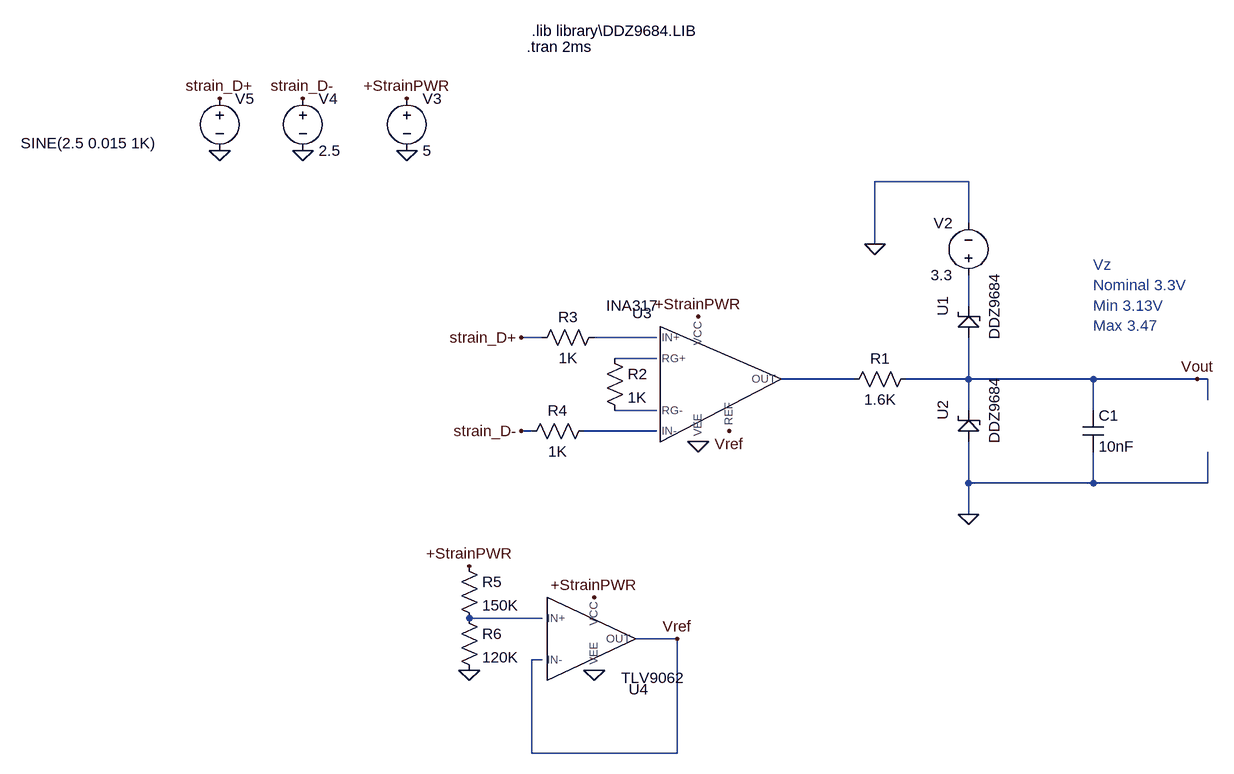
[diagram p0: schematic amplifierClamped.asc]
amplifierClamped.asc, the LTspice schematic file:
Version 4.1
SHEET 1 900 804
WIRE 448 -192 304 -192
WIRE 448 -128 448 -192
WIRE 304 -96 304 -192
WIRE 448 0 448 -48
WIRE -208 48 -240 48
WIRE -32 48 -128 48
WIRE -32 80 -96 80
WIRE 272 112 160 112
WIRE 448 112 448 48
WIRE 448 112 352 112
WIRE 640 112 448 112
WIRE 800 112 640 112
WIRE 816 112 800 112
WIRE 816 144 816 112
WIRE -32 160 -96 160
WIRE 448 160 448 112
WIRE 640 160 640 112
WIRE -224 192 -240 192
WIRE -32 192 -144 192
WIRE 448 272 448 208
WIRE 640 272 640 224
WIRE 640 272 448 272
WIRE 816 272 816 224
WIRE 816 272 640 272
WIRE 448 320 448 272
WIRE -208 480 -320 480
WIRE 0 512 -64 512
WIRE -208 544 -224 544
WIRE -224 688 -224 544
WIRE 0 688 0 512
WIRE 0 688 -224 688
FLAG 448 320 0
FLAG 304 -96 0
FLAG 800 112 Vout
FLAG -416 -240 0
FLAG -320 560 0
FLAG 0 512 Vref
FLAG 32 208 0
FLAG -128 560 0
FLAG 80 192 Vref
FLAG -576 -320 strain_D-
FLAG -576 -240 0
FLAG -704 -320 strain_D+
FLAG -704 -240 0
FLAG -240 192 strain_D-
FLAG -240 48 strain_D+
FLAG -416 -320 +StrainPWR
FLAG 32 16 +StrainPWR
FLAG -128 448 +StrainPWR
FLAG -320 400 +StrainPWR
SYMBOL res 368 96 R90
WINDOW 0 0 56 VBottom 2
WINDOW 3 32 56 VTop 2
SYMATTR InstName R1
SYMATTR Value 1.6K
SYMBOL voltage 448 -32 R180
WINDOW 0 24 96 Left 2
WINDOW 3 24 16 Left 2
WINDOW 123 0 0 Left 0
WINDOW 39 0 0 Left 0
SYMATTR InstName V2
SYMATTR Value 3.3
SYMBOL cap 624 160 R0
SYMATTR InstName C1
SYMATTR Value 10nF
SYMBOL library\\DDZ9684 448 0 R270
SYMATTR InstName U1
SYMBOL library\\DDZ9684 448 160 R270
SYMATTR InstName U2
SYMBOL library\\INA317 32 112 R0
SYMATTR InstName U3
SYMBOL res -112 64 R0
SYMATTR InstName R2
SYMATTR Value 1K
SYMBOL voltage -416 -336 R0
WINDOW 123 0 0 Left 0
WINDOW 39 0 0 Left 0
SYMATTR InstName V3
SYMATTR Value 5
SYMBOL res -128 176 R90
WINDOW 0 0 56 VBottom 2
WINDOW 3 32 56 VTop 2
SYMATTR InstName R4
SYMATTR Value 1K
SYMBOL res -336 384 R0
SYMATTR InstName R5
SYMATTR Value 150K
SYMBOL res -336 464 R0
SYMATTR InstName R6
SYMATTR Value 120K
SYMBOL library\\TLV9062 -144 512 R0
SYMATTR InstName U4
SYMBOL res -112 32 R90
WINDOW 0 0 56 VBottom 2
WINDOW 3 32 56 VTop 2
SYMATTR InstName R3
SYMATTR Value 1K
SYMBOL voltage -576 -336 R0
WINDOW 123 0 0 Left 0
WINDOW 39 0 0 Left 0
SYMATTR InstName V4
SYMATTR Value 2.5
SYMBOL voltage -704 -336 R0
WINDOW 3 -306 85 Left 2
WINDOW 123 0 0 Left 0
WINDOW 39 0 0 Left 0
SYMATTR Value SINE(2.5 0.015 1K)
SYMATTR InstName V5
TEXT -224 -424 Left 2 !.lib library\\DDZ9684.LIB
TEXT 640 -64 Left 2 ;Vz\nNominal 3.3V\nMin 3.13V\nMax 3.47
TEXT -232 -400 Left 2 !.tran 2ms

The netlist it stands for:
* amplifierClamped.asc
R1 Vout N004 1.6K
V2 N001 0 3.3
C1 Vout 0 10nF
X§U1 Vout N001 DDZ9684
X§U2 0 Vout DDZ9684
X§U3 N002 N006 +StrainPWR 0 N004 Vref N003 N005 INA317  ; pins IN+ IN- VCC VEE OUT REF RG+ RG-
R2 N003 N005 1K
V3 +StrainPWR 0 5
R4 N006 strain_D- 1K
R5 +StrainPWR N007 150K
R6 N007 0 120K
X§U4 N007 Vref +StrainPWR 0 Vref TLV9062  ; pins IN+ IN- VCC VEE OUT
R3 N002 strain_D+ 1K
V4 strain_D- 0 2.5
V5 strain_D+ 0 SINE(2.5 0.015 1K)
.lib library\DDZ9684.LIB
* Vz
* Nominal 3.3V
* Min 3.13V
* Max 3.47
.tran 2ms
.lib C:\Users\Parry\Documents\BCIT-BAJA\testing\LTSPICE_SIMS\library\DDZ9684.LIB
.lib C:\Users\Parry\Documents\BCIT-BAJA\testing\LTSPICE_SIMS\library\INA317.LIB
.lib C:\Users\Parry\Documents\BCIT-BAJA\testing\LTSPICE_SIMS\library\tlv9062.LIB
.backanno
.end